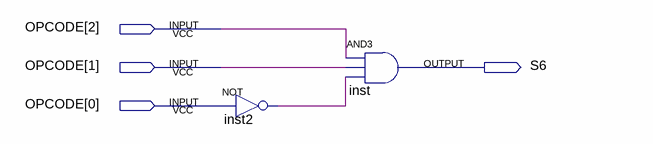
[diagram p0: schematic sheet]
// Quartus schematic DecoOR.bdf as structural Verilog: 2 symbols, 4 pins
module DecoOR (
  input  [2:0] OPCODE,
  output S6
);

  wire inst2_out;

  not inst2 (inst2_out, OPCODE[0]);
  and inst (S6, OPCODE[2], OPCODE[1], inst2_out);
endmodule
